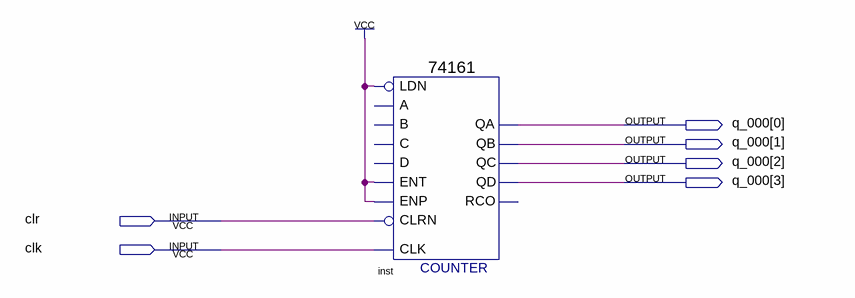
[diagram p0: schematic sheet]
// Quartus schematic cnt16.bdf as structural Verilog: 1 symbols, 6 pins
module cnt16 (
  input  clr,
  input  clk,
  output [3:0] q_000
);

  \74161  inst (
    .CLRN(clr), .CLK(clk), .ENP(1'b1), .LDN(1'b1), .ENT(1'b1), .QD(q_000[3]), .QC(q_000[2]), .QB(q_000[1]),
    .QA(q_000[0]));  // open: A, D, B, C, RCO
endmodule
